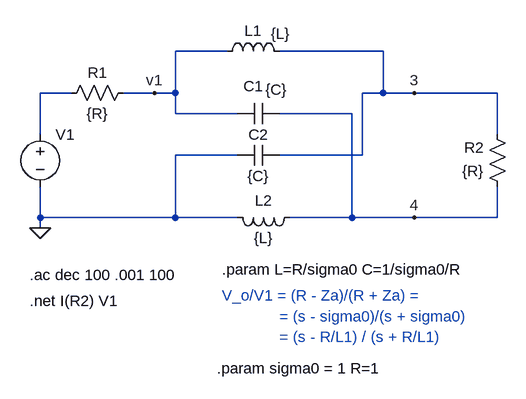
[diagram p0: schematic lattice_1ord_delay_eq.asc]
lattice_1ord_delay_eq.asc, the LTspice schematic file:
Version 4
SHEET 1 1116 1328
WIRE 288 400 208 400
WIRE 528 400 368 400
WIRE 48 464 0 464
WIRE 176 464 128 464
WIRE 208 464 208 400
WIRE 208 464 176 464
WIRE 528 464 528 400
WIRE 528 464 496 464
WIRE 576 464 528 464
WIRE 704 464 576 464
WIRE 208 496 208 464
WIRE 304 496 208 496
WIRE 480 496 368 496
WIRE 0 528 0 464
WIRE 704 528 704 464
WIRE 304 560 208 560
WIRE 496 560 496 464
WIRE 496 560 368 560
WIRE 0 656 0 608
WIRE 208 656 208 560
WIRE 208 656 0 656
WIRE 304 656 208 656
WIRE 480 656 480 496
WIRE 480 656 384 656
WIRE 576 656 480 656
WIRE 704 656 704 608
WIRE 704 656 576 656
WIRE 0 672 0 656
FLAG 0 672 0
FLAG 176 464 v1
FLAG 576 464 3
FLAG 576 656 4
SYMBOL voltage 0 512 R0
WINDOW 3 24 96 Invisible 2
SYMATTR Value 0
SYMATTR InstName V1
SYMATTR Value2 AC 1 0
SYMATTR SpiceLine Rser=0
SYMBOL res 144 448 R90
WINDOW 0 0 56 VBottom 2
WINDOW 3 32 56 VTop 2
SYMATTR InstName R1
SYMATTR Value {R}
SYMBOL res 720 624 R180
WINDOW 0 36 76 Left 2
WINDOW 3 36 40 Left 2
SYMATTR InstName R2
SYMATTR Value {R}
SYMBOL ind 272 416 R270
WINDOW 0 32 56 VTop 2
WINDOW 3 59 98 VBottom 2
SYMATTR InstName L1
SYMATTR Value {L}
SYMATTR SpiceLine Rser=0
SYMBOL cap 368 480 R90
WINDOW 0 -11 40 VBottom 2
WINDOW 3 -37 4 VTop 2
SYMATTR InstName C1
SYMATTR Value {C}
SYMBOL ind 400 640 R90
WINDOW 0 5 56 VBottom 2
WINDOW 3 32 56 VTop 2
SYMATTR InstName L2
SYMATTR Value {L}
SYMATTR SpiceLine Rser=0
SYMBOL cap 304 576 R270
WINDOW 0 32 32 VTop 2
WINDOW 3 0 32 VBottom 2
SYMATTR InstName C2
SYMATTR Value {C}
TEXT -16 784 Left 2 !.net I(R2) V1
TEXT -16 744 Left 2 !.ac dec 100 .001 100
TEXT 280 736 Left 2 !.param L=R/sigma0 C=1/sigma0/R
TEXT 272 888 Left 2 !.param sigma0 = 1 R=1
TEXT 280 776 Left 2 ;V_o/V1 = (R - Za)/(R + Za) =
TEXT 368 808 Left 2 ;= (s - sigma0)/(s + sigma0)
TEXT 368 840 Left 2 ;= (s - R/L1) / (s + R/L1)

The netlist it stands for:
* lattice_1ord_delay_eq.asc
V1 N001 0 0 AC 1 0 Rser=0
R1 v1 N001 {R}
R2 4 3 {R}
L1 v1 3 {L} Rser=0
C1 4 v1 {C}
L2 4 0 {L} Rser=0
C2 0 3 {C}
.net I(R2) V1
.ac dec 100 .001 100
.param L=R/sigma0 C=1/sigma0/R
.param sigma0 = 1 R=1
* V_o/V1 = (R - Za)/(R + Za) =
* = (s - sigma0)/(s + sigma0)
* = (s - R/L1) / (s + R/L1)
.backanno
.end